# Altium project PCB_Project.PrjPcb
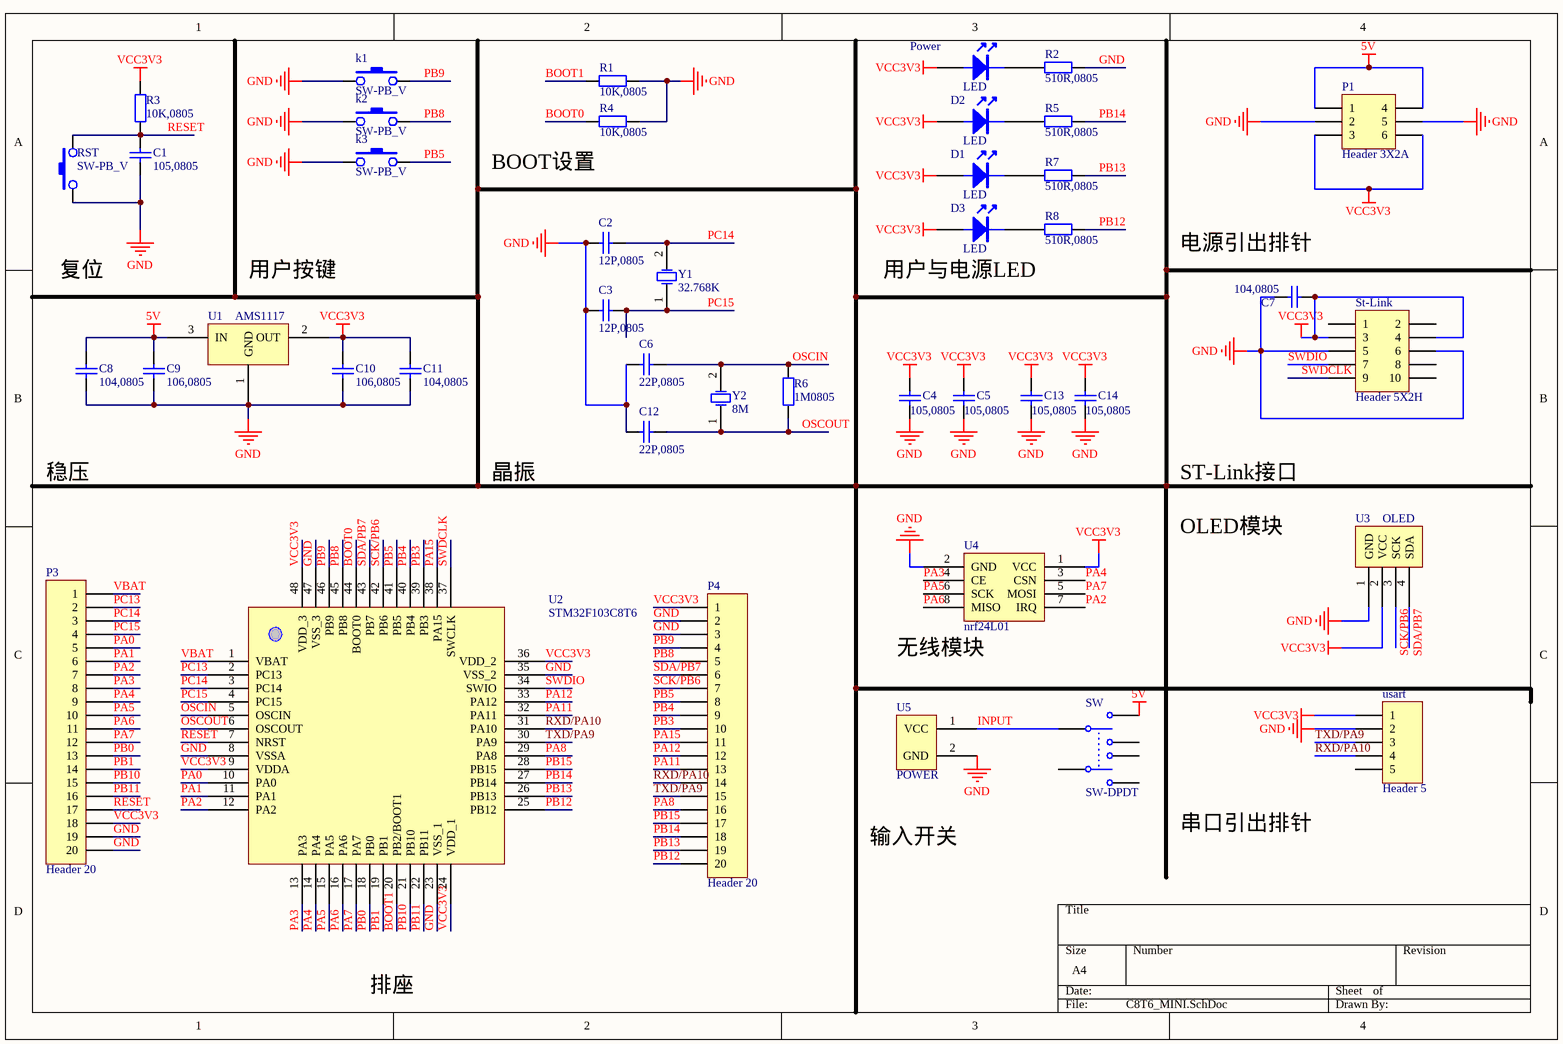
[diagram p0: C8T6_MINI.SchDoc]
1 sheet, 43 parts. Net scope: global (net labels, ports and power ports of the same name join across sheets).
Board file: C8T6_MINI.PcbDoc

## Sheet C8T6_MINI.SchDoc
size A4

### Parts
C1  105,0805  [6-0805_M]
C2  12P,0805  [6-0805_N]
C3  12P,0805  [6-0805_N]
C4  105,0805  [6-0805_N]
C5  105,0805  [6-0805_N]
C6  22P,0805  [6-0805_N]
C7  104,0805  [6-0805_N]
C8  104,0805  [6-0805_N]
C9  106,0805  [6-0805_N]
C10  106,0805  [6-0805_N]
C11  104,0805  [6-0805_N]
C12  22P,0805  [6-0805_N]
C13  105,0805  [6-0805_N]
C14  105,0805  [6-0805_N]
D1  LED  [LED 0805G]
D2  LED  [LED 0805G]
D3  LED  [LED 0805G]
k1  SW-PB_V  [TSW SMD-3*6*2.5]
k2  SW-PB_V  [TSW SMD-3*6*2.5]
k3  SW-PB_V  [TSW SMD-3*6*2.5]
P1  Header 3X2A  [HDR2X3_CEN]
P3  Header 20  [HDR1X20]
P4  Header 20  [HDR1X20]
Power  LED  [LED 0805G]
R1  10K,0805  [6-0805_N]
R2  510R,0805  [6-0805_N]
R3  10K,0805  [6-0805_N]
R4  10K,0805  [6-0805_N]
R5  510R,0805  [6-0805_N]
R6  1M0805  [6-0805_N]
R7  510R,0805  [6-0805_N]
R8  510R,0805  [6-0805_N]
RST  SW-PB_V  [TSW SMD-3*6*2.5]
St-Link  Header 5X2H  [HDR2X5H]
SW  SW-DPDT  [PCBComponent_1]
U1  AMS1117  [SOT223_M]
U2  STM32F103C8T6  [TQFP48 7x7_L]
U3  OLED  [OLED]
U4  nrf24L01  [NRF24L01]
U5  POWER  [power]
usart  Header 5  [HDR1X5]
Y1  32.768K  [圆柱晶振]
Y2  8M  [XTAL-49S DIP]

### Nets
5V: C8.1 C9.1 P1.1 P1.4 SW.2 U1.3(IN)
GND: C1.1 C2.2 C3.2 C4.1 C5.1 C6.2 C7.2 C8.2 C9.2 C10.1 C11.1 C12.2 C13.1 C14.1 k1.1 k2.1 k3.1 P1.2 P1.5 P3.19 P3.20 P4.2 P4.3 R1.2 R2.2 R4.2 RST.1 St-Link.5 St-Link.6 U1.1(GND) U2.8(VSSA) U2.23(VSS_1) U2.35(VSS_2) U2.47(VSS_3) U3.1(GND) U4.2(GND) U5.2(GND) usart.2
VCC3V3: C4.2 C5.2 C7.1 C10.2 C11.2 C13.2 C14.2 D1.1 D2.1 D3.1 P1.3 P1.6 P3.18 P4.1 Power.1 R3.2 St-Link.3 St-Link.4 U1.2(OUT) U2.9(VDDA) U2.24(VDD_1) U2.36(VDD_2) U2.48(VDD_3) U3.2(VCC) U4.1(VCC) usart.1
BOOT0: R4.1 U2.44(BOOT0)
BOOT1: R1.1 U2.20(PB2/BOOT1)
INPUT: SW.1 U5.1(VCC)
OSCIN: C6.1 R6.2 U2.5(OSCIN) Y2.2(OSC2)
OSCOUT: C12.1 R6.1 U2.6(OSCOUT) Y2.1(OSC1)
PA0: P3.5 U2.10(PA0)
PA1: P3.6 U2.11(PA1)
PA2: P3.7 U2.12(PA2) U4.7(IRQ)
PA3: P3.8 U2.13(PA3) U4.4(CE)
PA4: P3.9 U2.14(PA4) U4.3(CSN)
PA5: P3.10 U2.15(PA5) U4.6(SCK)
PA6: P3.11 U2.16(PA6) U4.8(MISO)
PA7: P3.12 U2.17(PA7) U4.5(MOSI)
PA8: P4.16 U2.29(PA8)
PA11: P4.13 U2.32(PA11)
PA12: P4.12 U2.33(PA12)
PA15: P4.11 U2.38(PA15)
PB0: P3.13 U2.18(PB0)
PB1: P3.14 U2.19(PB1)
PB3: P4.10 U2.39(PB3)
PB4: P4.9 U2.40(PB4)
PB5: k3.2 P4.8 U2.41(PB5)
PB8: k2.2 P4.5 U2.45(PB8)
PB9: k1.2 P4.4 U2.46(PB9)
PB10: P3.15 U2.21(PB10)
PB11: P3.16 U2.22(PB11)
PB12: P4.20 R8.2 U2.25(PB12)
PB13: P4.19 R7.2 U2.26(PB13)
PB14: P4.18 R5.2 U2.27(PB14)
PB15: P4.17 U2.28(PB15)
PC13: P3.2 U2.2(PC13)
PC14: C2.1 P3.3 U2.3(PC14) Y1.2(OSC2)
PC15: C3.1 P3.4 U2.4(PC15) Y1.1(OSC1)
RESET: C1.2 P3.17 R3.1 RST.2 U2.7(NRST)
RXD/PA10: P4.14 U2.31(PA10) usart.4
SCK/PB6: P4.7 U2.42(PB6) U3.3(SCK)
SDA/PB7: P4.6 U2.43(PB7) U3.4(SDA)
SWDCLK: St-Link.9 U2.37(SWCLK)
SWDIO: St-Link.7 U2.34(SWIO)
TXD/PA9: P4.15 U2.30(PA9) usart.3
VBAT: P3.1 U2.1(VBAT)
NetD1_2: D1.2 R7.1
NetD2_2: D2.2 R5.1
NetD3_2: D3.2 R8.1
NetPower_2: Power.2 R2.1

Not connected (* = marked no-connect by the designer): St-Link 1 2 8 10; SW 3 4 5 6; usart 5

### Notes on the sheet
- BOOT设置
- 电源引出排针
- 复位
- 用户按键
- (near D3) 用户与电源LED
- 稳压
- 晶振
- ST-Link接口
- OLED模块
- (near U4) 无线模块
- 输入开关
- 串口引出排针
- 排座

### Library data of the parts
C1 = Cap: Capacitor; Value: 104; Published: 8-Jun-2000; LatestRevisionDate: 17-Jul-2002; LatestRevisionNote: Re-released for DXP Platform.; Publisher: Altium Limited
C2-C14 = Cap_2: Capacitor; Value: 104; Published: 8-Jun-2000; LatestRevisionDate: 17-Jul-2002; LatestRevisionNote: Re-released for DXP Platform.; Publisher: Altium Limited
k1-k3 RST = SW-PB_V: SWITCH
P1 = Header 3X2A: Header, 3-Pin, Dual row; LatestRevisionDate: 17-Jul-2002; LatestRevisionNote: Re-released for DXP Platform.; Publisher: Altium Limited
P3 P4 = Header 20: Header, 20-Pin; LatestRevisionDate: 17-Jul-2002; LatestRevisionNote: Re-released for DXP Platform.; Publisher: Altium Limited
R1-R8 = Res2: Resistor; Published: 8-Jun-2000; LatestRevisionDate: 17-Jul-2002; LatestRevisionNote: Re-released for DXP Platform.; Publisher: Altium Limited
St-Link = Header 5X2H: Header, 5-Pin, Dual row, Right Angle; LatestRevisionDate: 17-Jul-2002; LatestRevisionNote: Re-released for DXP Platform.; Publisher: Altium Limited
SW = SW-DPDT: Double-Pole, Double-Throw Switch; Published: 24-Mar-1999; LatestRevisionDate: 17-Jul-2002; LatestRevisionNote: Re-released for DXP Platform.; PackageReference: DPDT-6; Publisher: Altium Limited; PackageDescription: Switch; 6 Leads
U1 = Component_1
usart = Header 5: Header, 5-Pin; LatestRevisionDate: 17-Jul-2002; LatestRevisionNote: Re-released for DXP Platform.; Publisher: Altium Limited
Y1 = XTAL_1: Crystal Oscillator; Published: 8-Jun-2000; LatestRevisionDate: 17-Jul-2002; LatestRevisionNote: Re-released for DXP Platform.; Publisher: Altium Limited
Y2 = XTAL: Crystal Oscillator; Published: 8-Jun-2000; LatestRevisionDate: 17-Jul-2002; LatestRevisionNote: Re-released for DXP Platform.; Publisher: Altium Limited